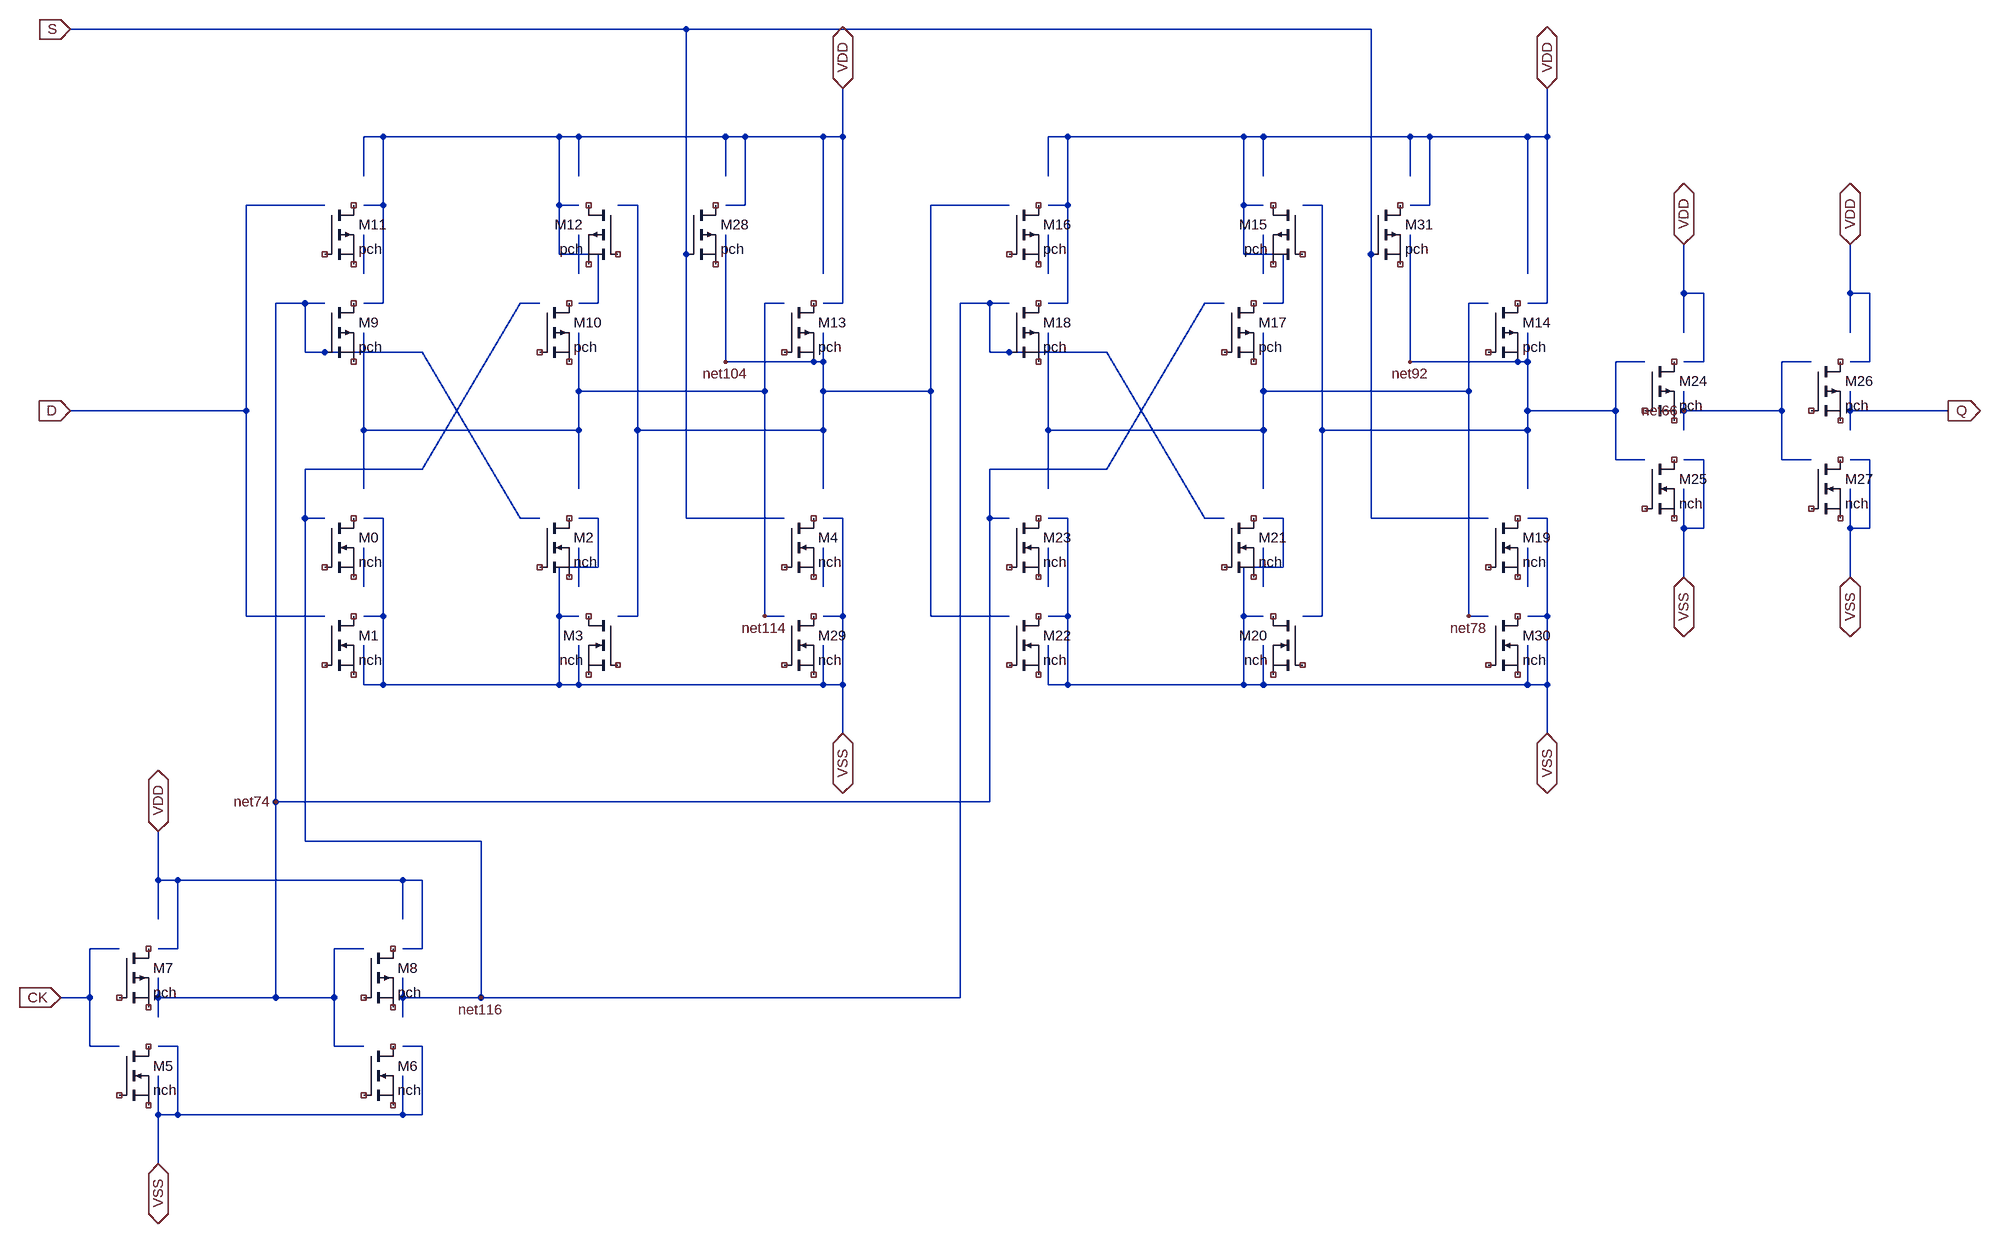
[diagram p0: schematic sff1.asc]
sff1.asc, the LTspice schematic file:
Version 4
SHEET 1 3264 1968
WIRE 1184 560 1184 352
WIRE 1344 560 1344 512
WIRE 1184 560 1344 560
WIRE 1520 304 1648 304
WIRE 1344 608 1520 608
WIRE 1344 672 1344 608
WIRE 1344 768 1344 672
WIRE 1520 976 1648 976
WIRE 1040 672 1040 304
WIRE 1040 672 1344 672
WIRE 1520 608 1520 304
WIRE 1520 976 1520 608
WIRE 1040 976 1040 672
WIRE 1008 976 1040 976
WIRE 1008 304 1040 304
WIRE 1344 608 1344 560
WIRE 2064 416 2064 352
WIRE 1344 928 1344 864
WIRE 592 416 592 352
WIRE 2064 928 2064 864
WIRE 448 1280 1616 1280
WIRE 1616 816 1648 816
WIRE 1616 816 1616 736
WIRE 1616 736 1808 736
WIRE 1968 464 2000 464
WIRE 1808 736 1968 464
WIRE 448 1600 544 1600
WIRE 448 1600 448 1280
WIRE 1616 1280 1616 816
WIRE 688 544 848 816
WIRE 256 1600 448 1600
WIRE 544 1600 544 1520
WIRE 448 464 496 464
WIRE 544 1680 544 1600
WIRE 256 1632 256 1600
WIRE 544 1520 592 1520
WIRE 544 1680 592 1680
WIRE 256 1600 256 1568
WIRE 448 1280 448 464
WIRE 848 816 880 816
WIRE 496 544 688 544
WIRE 496 544 496 464
WIRE 496 464 528 464
WIRE 944 928 944 864
WIRE 1712 928 1712 864
WIRE 112 640 400 640
WIRE 400 640 400 304
WIRE 400 976 528 976
WIRE 400 976 400 640
WIRE 400 304 528 304
WIRE 3024 640 3184 640
WIRE 3024 640 3024 608
WIRE 3024 672 3024 640
WIRE 944 608 944 512
WIRE 1248 976 1280 976
WIRE 944 608 1248 608
WIRE 1248 976 1248 608
WIRE 944 672 944 608
WIRE 1248 464 1280 464
WIRE 592 672 944 672
WIRE 1248 608 1248 464
WIRE 592 672 592 512
WIRE 944 768 944 672
WIRE 592 768 592 672
WIRE 944 416 944 352
WIRE 1712 416 1712 352
WIRE 2752 640 2912 640
WIRE 2912 640 2912 560
WIRE 2752 640 2752 608
WIRE 2912 720 2912 640
WIRE 2912 720 2960 720
WIRE 2912 560 2960 560
WIRE 2752 672 2752 640
WIRE 2400 976 2432 976
WIRE 1712 768 1712 672
WIRE 2064 768 2064 672
WIRE 2064 608 2400 608
WIRE 2400 608 2400 464
WIRE 2064 608 2064 512
WIRE 1712 672 1712 512
WIRE 1712 672 2064 672
WIRE 2400 464 2432 464
WIRE 2064 672 2064 608
WIRE 2400 976 2400 608
WIRE 592 928 592 864
WIRE 784 1600 1568 1600
WIRE 1568 464 1616 464
WIRE 1616 464 1648 464
WIRE 1616 544 1616 464
WIRE 1616 544 1808 544
WIRE 1968 816 2000 816
WIRE 1808 544 1968 816
WIRE 1568 1600 1568 464
WIRE 656 1600 656 1568
WIRE 496 1344 784 1344
WIRE 656 1600 784 1600
WIRE 784 1600 784 1344
WIRE 496 1344 496 816
WIRE 688 736 848 464
WIRE 656 1632 656 1600
WIRE 848 464 880 464
WIRE 496 736 688 736
WIRE 496 816 496 736
WIRE 496 816 528 816
WIRE 1120 816 1120 304
WIRE 1120 816 1280 816
WIRE 1120 16 2240 16
WIRE 1120 304 1120 16
WIRE 2240 304 2240 16
WIRE 2240 816 2432 816
WIRE 112 16 1120 16
WIRE 2240 816 2240 304
WIRE 1216 304 1216 192
WIRE 1184 304 1216 304
WIRE 944 192 1184 192
WIRE 1216 192 1344 192
WIRE 2304 192 2336 192
WIRE 2304 256 2304 192
WIRE 2304 304 2336 304
WIRE 2336 192 2496 192
WIRE 2336 304 2336 192
WIRE 3056 560 3056 448
WIRE 3024 448 3056 448
WIRE 3024 560 3056 560
WIRE 3024 512 3024 448
WIRE 3024 448 3024 368
WIRE 2064 192 2304 192
WIRE 2784 560 2784 448
WIRE 2752 448 2784 448
WIRE 2752 560 2784 560
WIRE 2752 512 2752 448
WIRE 2752 448 2752 368
WIRE 1712 256 1712 192
WIRE 1712 192 1744 192
WIRE 2064 256 2064 192
WIRE 2064 464 2096 464
WIRE 2096 464 2096 384
WIRE 2032 384 2096 384
WIRE 2032 192 2064 192
WIRE 2032 384 2032 304
WIRE 2032 304 2032 192
WIRE 2032 304 2064 304
WIRE 1712 464 1744 464
WIRE 1744 192 2032 192
WIRE 1744 464 1744 304
WIRE 1744 304 1744 192
WIRE 1712 304 1744 304
WIRE 2496 416 2496 192
WIRE 2496 464 2528 464
WIRE 2528 464 2528 192
WIRE 2496 192 2528 192
WIRE 2528 192 2528 112
WIRE 256 1408 256 1328
WIRE 656 1408 688 1408
WIRE 688 1520 688 1408
WIRE 656 1520 688 1520
WIRE 288 1520 288 1408
WIRE 256 1520 288 1520
WIRE 656 1472 656 1408
WIRE 256 1472 256 1408
WIRE 256 1408 288 1408
WIRE 1376 192 1376 112
WIRE 1184 256 1184 192
WIRE 1344 192 1376 192
WIRE 1376 464 1376 192
WIRE 1344 464 1376 464
WIRE 1344 416 1344 192
WIRE 1184 192 1216 192
WIRE 592 304 624 304
WIRE 624 304 624 192
WIRE 624 464 624 304
WIRE 624 192 912 192
WIRE 592 464 624 464
WIRE 912 304 944 304
WIRE 912 304 912 192
WIRE 912 384 912 304
WIRE 912 192 944 192
WIRE 912 384 976 384
WIRE 976 464 976 384
WIRE 944 464 976 464
WIRE 944 256 944 192
WIRE 592 192 624 192
WIRE 592 256 592 192
WIRE 288 1408 656 1408
WIRE 2496 928 2496 864
WIRE 2304 560 2304 352
WIRE 2496 560 2496 512
WIRE 2304 560 2496 560
WIRE 2640 640 2640 560
WIRE 2640 720 2640 640
WIRE 2496 768 2496 672
WIRE 2640 720 2688 720
WIRE 2640 560 2688 560
WIRE 2496 640 2640 640
WIRE 2496 640 2496 560
WIRE 2496 672 2496 640
WIRE 2128 304 2160 304
WIRE 2128 976 2160 976
WIRE 2160 976 2160 672
WIRE 2160 672 2160 304
WIRE 2160 672 2496 672
WIRE 96 1600 144 1600
WIRE 144 1600 144 1520
WIRE 144 1680 192 1680
WIRE 144 1680 144 1600
WIRE 144 1520 192 1520
WIRE 1344 816 1376 816
WIRE 1376 1088 1376 976
WIRE 1376 976 1376 816
WIRE 1344 976 1376 976
WIRE 1344 1088 1376 1088
WIRE 1344 1088 1344 1024
WIRE 2496 1088 2496 1024
WIRE 2528 976 2528 816
WIRE 2496 976 2528 976
WIRE 3024 832 3024 912
WIRE 3056 832 3056 720
WIRE 3024 832 3056 832
WIRE 3024 720 3056 720
WIRE 3024 768 3024 832
WIRE 2752 832 2752 912
WIRE 2784 832 2784 720
WIRE 2752 832 2784 832
WIRE 2752 720 2784 720
WIRE 2752 768 2752 832
WIRE 1712 1088 1712 1024
WIRE 1712 1088 1744 1088
WIRE 2064 1088 2064 1024
WIRE 1712 816 1744 816
WIRE 1744 1088 2032 1088
WIRE 1744 1088 1744 976
WIRE 1744 976 1744 816
WIRE 1712 976 1744 976
WIRE 2064 816 2096 816
WIRE 2096 896 2096 816
WIRE 2032 896 2096 896
WIRE 2032 1088 2064 1088
WIRE 2032 1088 2032 976
WIRE 2032 976 2032 896
WIRE 2032 976 2064 976
WIRE 2496 1088 2528 1088
WIRE 2496 816 2528 816
WIRE 2528 1088 2528 976
WIRE 2064 1088 2496 1088
WIRE 2528 1088 2528 1168
WIRE 256 1792 256 1872
WIRE 656 1792 688 1792
WIRE 688 1792 688 1680
WIRE 656 1680 688 1680
WIRE 288 1792 288 1680
WIRE 256 1680 288 1680
WIRE 256 1728 256 1792
WIRE 256 1792 288 1792
WIRE 656 1728 656 1792
WIRE 1376 1088 1376 1168
WIRE 944 1088 1344 1088
WIRE 912 976 944 976
WIRE 912 976 912 896
WIRE 912 1088 912 976
WIRE 912 1088 944 1088
WIRE 912 896 976 896
WIRE 976 896 976 816
WIRE 944 816 976 816
WIRE 592 976 624 976
WIRE 624 976 624 816
WIRE 624 1088 624 976
WIRE 624 1088 912 1088
WIRE 592 816 624 816
WIRE 944 1088 944 1024
WIRE 592 1088 624 1088
WIRE 592 1088 592 1024
WIRE 288 1792 656 1792
FLAG 1184 560 net104
FLAG 448 1280 net74
FLAG 1248 976 net114
FLAG 2752 640 net66
FLAG 2400 976 net78
FLAG 784 1600 net116
FLAG 2304 560 net92
SYMBOL PMOS 1120 304 R0
SYMATTR InstName M28
SYMATTR Value pch
SYMATTR Value2 w=6u l=1u
SYMBOL PMOS 2240 304 R0
SYMATTR InstName M31
SYMATTR Value pch
SYMATTR Value2 w=6u l=1u
SYMBOL PMOS 2960 560 R0
SYMATTR InstName M26
SYMATTR Value pch
SYMATTR Value2 w=6u l=1u
SYMBOL PMOS 2688 560 R0
SYMATTR InstName M24
SYMATTR Value pch
SYMATTR Value2 w=6u l=1u
SYMBOL PMOS 1648 464 R0
SYMATTR InstName M18
SYMATTR Value pch
SYMATTR Value2 w=6u l=1u
SYMBOL PMOS 2000 464 R0
SYMATTR InstName M17
SYMATTR Value pch
SYMATTR Value2 w=6u l=1u
SYMBOL PMOS 1648 304 R0
SYMATTR InstName M16
SYMATTR Value pch
SYMATTR Value2 w=6u l=1u
SYMBOL PMOS 2128 304 M0
SYMATTR InstName M15
SYMATTR Value pch
SYMATTR Value2 w=6u l=1u
SYMBOL PMOS 2432 464 R0
SYMATTR InstName M14
SYMATTR Value pch
SYMATTR Value2 w=6u l=1u
SYMBOL PMOS 1280 464 R0
SYMATTR InstName M13
SYMATTR Value pch
SYMATTR Value2 w=6u l=1u
SYMBOL PMOS 1008 304 M0
SYMATTR InstName M12
SYMATTR Value pch
SYMATTR Value2 w=6u l=1u
SYMBOL PMOS 528 304 R0
SYMATTR InstName M11
SYMATTR Value pch
SYMATTR Value2 w=6u l=1u
SYMBOL PMOS 880 464 R0
SYMATTR InstName M10
SYMATTR Value pch
SYMATTR Value2 w=6u l=1u
SYMBOL PMOS 528 464 R0
SYMATTR InstName M9
SYMATTR Value pch
SYMATTR Value2 w=6u l=1u
SYMBOL PMOS 592 1520 R0
SYMATTR InstName M8
SYMATTR Value pch
SYMATTR Value2 w=6u l=1u
SYMBOL PMOS 192 1520 R0
SYMATTR InstName M7
SYMATTR Value pch
SYMATTR Value2 w=6u l=1u
SYMBOL NMOS 2960 720 R0
SYMATTR InstName M27
SYMATTR Value nch
SYMATTR Value2 w=2u l=1u
SYMBOL NMOS 2688 720 R0
SYMATTR InstName M25
SYMATTR Value nch
SYMATTR Value2 w=2u l=1u
SYMBOL NMOS 2432 976 R0
SYMATTR InstName M30
SYMATTR Value nch
SYMATTR Value2 w=2u l=1u
SYMBOL NMOS 1648 816 R0
SYMATTR InstName M23
SYMATTR Value nch
SYMATTR Value2 w=2u l=1u
SYMBOL NMOS 1648 976 R0
SYMATTR InstName M22
SYMATTR Value nch
SYMATTR Value2 w=2u l=1u
SYMBOL NMOS 2000 816 R0
SYMATTR InstName M21
SYMATTR Value nch
SYMATTR Value2 w=2u l=1u
SYMBOL NMOS 2128 976 M0
SYMATTR InstName M20
SYMATTR Value nch
SYMATTR Value2 w=2u l=1u
SYMBOL NMOS 2432 816 R0
SYMATTR InstName M19
SYMATTR Value nch
SYMATTR Value2 w=2u l=1u
SYMBOL NMOS 1280 976 R0
SYMATTR InstName M29
SYMATTR Value nch
SYMATTR Value2 w=2u l=1u
SYMBOL NMOS 592 1680 R0
SYMATTR InstName M6
SYMATTR Value nch
SYMATTR Value2 w=2u l=1u
SYMBOL NMOS 192 1680 R0
SYMATTR InstName M5
SYMATTR Value nch
SYMATTR Value2 w=2u l=1u
SYMBOL NMOS 1280 816 R0
SYMATTR InstName M4
SYMATTR Value nch
SYMATTR Value2 w=2u l=1u
SYMBOL NMOS 1008 976 M0
SYMATTR InstName M3
SYMATTR Value nch
SYMATTR Value2 w=2u l=1u
SYMBOL NMOS 880 816 R0
SYMATTR InstName M2
SYMATTR Value nch
SYMATTR Value2 w=2u l=1u
SYMBOL NMOS 528 976 R0
SYMATTR InstName M1
SYMATTR Value nch
SYMATTR Value2 w=2u l=1u
SYMBOL NMOS 528 816 R0
SYMATTR InstName M0
SYMATTR Value nch
SYMATTR Value2 w=2u l=1u
FLAG 3184 640 Q
IOPIN 3184 640 Out
FLAG 3024 368 VDD
IOPIN 3024 368 BiDir
FLAG 3024 912 VSS
IOPIN 3024 912 BiDir
FLAG 2752 368 VDD
IOPIN 2752 368 BiDir
FLAG 2752 912 VSS
IOPIN 2752 912 BiDir
FLAG 2528 1168 VSS
IOPIN 2528 1168 BiDir
FLAG 2528 112 VDD
IOPIN 2528 112 BiDir
FLAG 256 1328 VDD
IOPIN 256 1328 BiDir
FLAG 256 1872 VSS
IOPIN 256 1872 BiDir
FLAG 1376 1168 VSS
IOPIN 1376 1168 BiDir
FLAG 1376 112 VDD
IOPIN 1376 112 BiDir
FLAG 112 16 S
IOPIN 112 16 In
FLAG 112 640 D
IOPIN 112 640 In
FLAG 96 1600 CK
IOPIN 96 1600 In

The netlist it stands for:
* sff1.asc
M28 NC_01 S NC_02 NC_02 pch w=6u l=1u
M31 NC_03 S NC_04 NC_04 pch w=6u l=1u
* M26: pch w=6u l=1u (symbol PMOS not certain, pin order unknown); nets seen at it: 
* M24: pch w=6u l=1u (symbol PMOS not certain, pin order unknown); nets seen at it: 
* M18: pch w=6u l=1u (symbol PMOS not certain, pin order unknown); nets seen at it: net116
* M17: pch w=6u l=1u (symbol PMOS not certain, pin order unknown); nets seen at it: 
* M16: pch w=6u l=1u (symbol PMOS not certain, pin order unknown); nets seen at it: 
* M15: pch w=6u l=1u (symbol PMOS not certain, pin order unknown); nets seen at it: 
* M14: pch w=6u l=1u (symbol PMOS not certain, pin order unknown); nets seen at it: net92
* M13: pch w=6u l=1u (symbol PMOS not certain, pin order unknown); nets seen at it: net104
* M12: pch w=6u l=1u (symbol PMOS not certain, pin order unknown); nets seen at it: 
* M11: pch w=6u l=1u (symbol PMOS not certain, pin order unknown); nets seen at it: 
* M10: pch w=6u l=1u (symbol PMOS not certain, pin order unknown); nets seen at it: 
* M9: pch w=6u l=1u (symbol PMOS not certain, pin order unknown); nets seen at it: net74
* M8: pch w=6u l=1u (symbol PMOS not certain, pin order unknown); nets seen at it: 
* M7: pch w=6u l=1u (symbol PMOS not certain, pin order unknown); nets seen at it: 
* M27: nch w=2u l=1u (symbol NMOS not certain, pin order unknown); nets seen at it: 
* M25: nch w=2u l=1u (symbol NMOS not certain, pin order unknown); nets seen at it: 
* M30: nch w=2u l=1u (symbol NMOS not certain, pin order unknown); nets seen at it: 
* M23: nch w=2u l=1u (symbol NMOS not certain, pin order unknown); nets seen at it: 
* M22: nch w=2u l=1u (symbol NMOS not certain, pin order unknown); nets seen at it: 
* M21: nch w=2u l=1u (symbol NMOS not certain, pin order unknown); nets seen at it: 
* M20: nch w=2u l=1u (symbol NMOS not certain, pin order unknown); nets seen at it: 
* M19: nch w=2u l=1u (symbol NMOS not certain, pin order unknown); nets seen at it: 
* M29: nch w=2u l=1u (symbol NMOS not certain, pin order unknown); nets seen at it: 
* M6: nch w=2u l=1u (symbol NMOS not certain, pin order unknown); nets seen at it: 
* M5: nch w=2u l=1u (symbol NMOS not certain, pin order unknown); nets seen at it: 
* M4: nch w=2u l=1u (symbol NMOS not certain, pin order unknown); nets seen at it: 
* M3: nch w=2u l=1u (symbol NMOS not certain, pin order unknown); nets seen at it: 
* M2: nch w=2u l=1u (symbol NMOS not certain, pin order unknown); nets seen at it: 
* M1: nch w=2u l=1u (symbol NMOS not certain, pin order unknown); nets seen at it: 
* M0: nch w=2u l=1u (symbol NMOS not certain, pin order unknown); nets seen at it: 
.model NMOS NMOS
.model PMOS PMOS
.lib standard.mos
.backanno
.end